# EAGLE design POE_plus_input (EAGLE 9.6.2)
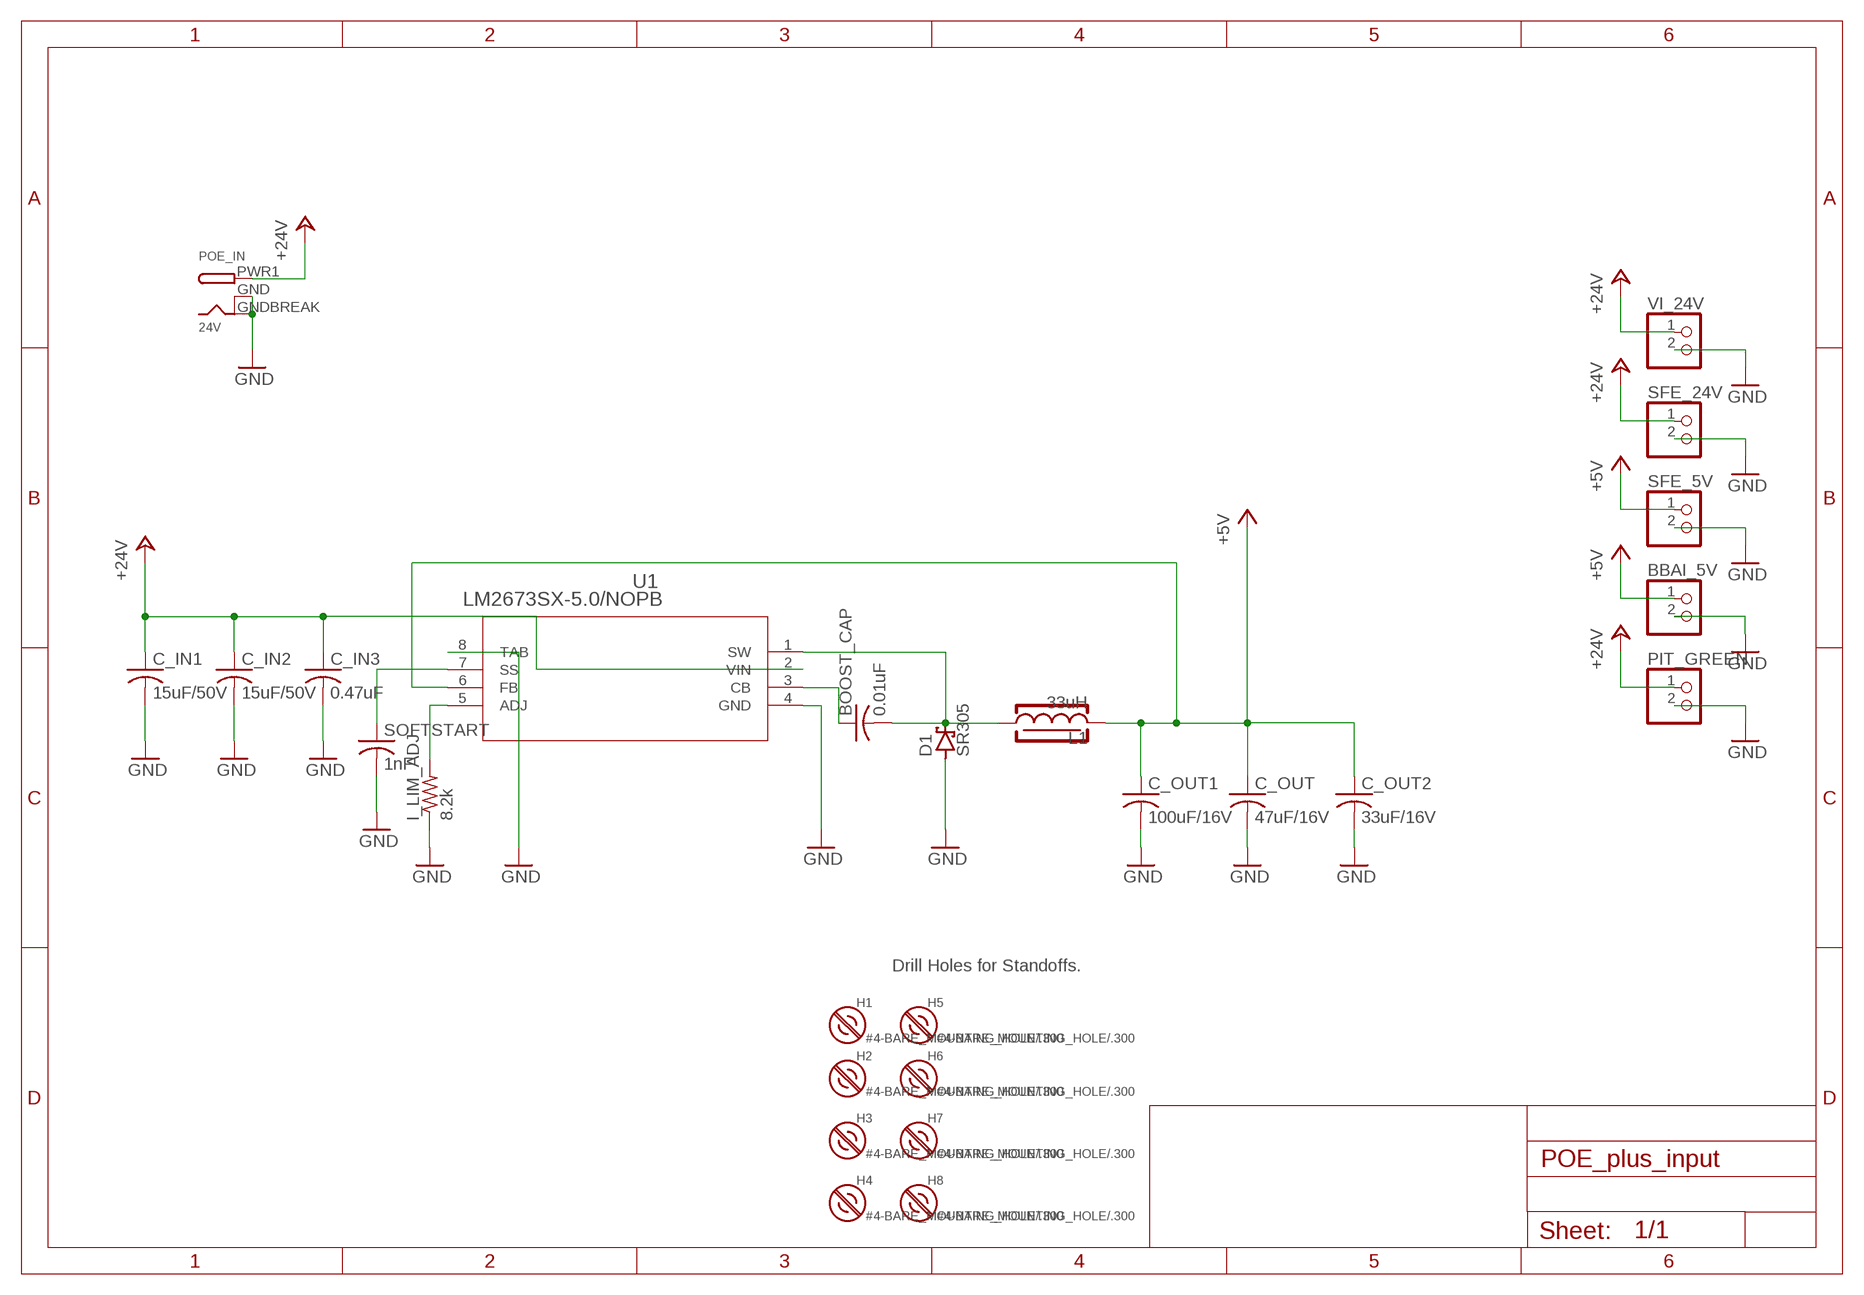
[diagram p0: schematic, sheet 1]

## Parts
BBAI_5V  PINHD-1X2  [1X02]
BOOST_CAP  0.01uF  C-USC0805K  [C0805K]
C_IN1  15uF/50V  C-USC2220K  [C2220K]
C_IN2  15uF/50V  C-USC2220K  [C2220K]
C_IN3  0.47uF  C-USC0805K  [C0805K]
C_OUT  47uF/16V  C-USC1210K  [C1210K]
C_OUT1  100uF/16V  C-USC1210K  [C1210K]
C_OUT2  33uF/16V  C-USC1206K  [C1206K]
D1  SR305  1N5908  [C4111-15]
H1  #4-BARE_MOUNTING_HOLE/.300  [#4/.300-BARE+STD_NUT_OR_STAR_WASHER]
H2  #4-BARE_MOUNTING_HOLE/.300  [#4/.300-BARE+STD_NUT_OR_STAR_WASHER]
H3  #4-BARE_MOUNTING_HOLE/.300  [#4/.300-BARE+STD_NUT_OR_STAR_WASHER]
H4  #4-BARE_MOUNTING_HOLE/.300  [#4/.300-BARE+STD_NUT_OR_STAR_WASHER]
H5  #4-BARE_MOUNTING_HOLE/.300  [#4/.300-BARE+STD_NUT_OR_STAR_WASHER]
H6  #4-BARE_MOUNTING_HOLE/.300  [#4/.300-BARE+STD_NUT_OR_STAR_WASHER]
H7  #4-BARE_MOUNTING_HOLE/.300  [#4/.300-BARE+STD_NUT_OR_STAR_WASHER]
H8  #4-BARE_MOUNTING_HOLE/.300  [#4/.300-BARE+STD_NUT_OR_STAR_WASHER]
I_LIM_ADJ  8.2k  R-US_1206-A  [1206-A]
L1  33uH  L_SHIELDED  [L_SHIELDED_13MMX13MMX6MM]
PIT_GREEN  PINHD-1X2  [1X02]
POE_IN  24V  DCBARRELSMT  [DCJACK_2MM_SMT]
SFE_5V  PINHD-1X2  [1X02]
SFE_24V  PINHD-1X2  [1X02]
SOFTSTART  1nF  C-USC0603K  [C0603K]
U1  LM2673SX-5.0/NOPB  [TS7B]
VI_24V  PINHD-1X2  [1X02]

## Nets
+5V: BBAI_5V.1 C_OUT1.1 C_OUT2.1 C_OUT.1 L1.2 SFE_5V.1 U1.6(FB)
+24V: C_IN1.1 C_IN2.1 C_IN3.1 PIT_GREEN.1 POE_IN.PWR1(PWR) SFE_24V.1 U1.2(VIN) VI_24V.1
GND: BBAI_5V.2 C_IN1.2 C_IN2.2 C_IN3.2 C_OUT1.2 C_OUT2.2 C_OUT.2 D1.A I_LIM_ADJ.1 PIT_GREEN.2 POE_IN.GND(GNDBREAK) POE_IN.GNDBREAK(GND) SFE_5V.2 SFE_24V.2 SOFTSTART.2 U1.4(GND) U1.8(TAB) VI_24V.2
N$1: SOFTSTART.1 U1.7(SS)
N$2: BOOST_CAP.2 D1.C L1.1 U1.1(SW)
N$6: I_LIM_ADJ.2 U1.5(ADJ)
N$7: BOOST_CAP.1 U1.3(CB)

## Notes on the sheet
- Drill Holes for Standoffs.

## Library data of the parts
BBAI_5V PIT_GREEN SFE_5V SFE_24V VI_24V = pinhead:PINHD-1X2: PIN HEADER; DIS: Digi-Key; DPN: WM10560CT-ND; MFR: Molex; MPN: 1718573002
BOOST_CAP = oresat-rcl:C-US: CAPACITOR, American symbol; DIS: Digi-Key; DPN: 478-5007-1-ND; MFR: AVX Corporation; MPN: 06035C103JAT2A
C_IN1 C_IN2 = oresat-rcl:C-US: CAPACITOR, American symbol; DIS: Digi-Key; DPN: 565-3335-1-ND; MFR: United Chemi-Con; MPN: KTS500B156M55N0T00
C_IN3 = oresat-rcl:C-US: CAPACITOR, American symbol; DIS: Digi-Key; DPN: 587-3171-1-ND; MFR: Taiyo Yuden; MPN: UMK107ABJ474KA-T
C_OUT = oresat-rcl:C-US: CAPACITOR, American symbol; DIS: Digi-Key; DPN: 490-16309-1-ND; MFR: Murata Electronics; MPN: GRM32EC81C476KE15K
C_OUT1 = oresat-rcl:C-US: CAPACITOR, American symbol; DIS: Digi-Key; DPN: 587-5426-1-ND; MFR: Taiyo Yuden; MPN: EMK325ABJ107MM-P
C_OUT2 = oresat-rcl:C-US: CAPACITOR, American symbol; DIS: Digi-Key; DPN: 445-6002-1-ND; MFR: TDK Corporation; MPN: C3216X5R1C336M160AB
D1 = diode:1N5908: DIODE schottky; DIS: Digi-Key; DPN: SR305-TPMSCT-ND; MFR: Micro Commercial Co; MPN: SR305-TP
H1-H8 = mount:#4-BARE_MOUNTING_HOLE: 1/8" drill hole for #4 screw mount
I_LIM_ADJ = oresat-rcl:R-US_: RESISTOR, American symbol; DIS: Digi-Key; DPN: 311-8.20KFRCT-ND; MFR: Yageo; MPN: RC1206FR-078K2L
L1 = oresat-rcl:L_SHIELDED: Wurth 6.0uH Shielded Inductor, 12A max Current, 14A Sat. Current, 8 mOhms, 13mm x 12.5mm x 6mm case, Wurth No. 7443551600, Digikey No. 732-1129-1-ND; DIS: Digi-Key; DPN: 553-1406-ND; MFR: Pulse Electronics Power; MPN: PE-53823SNL
POE_IN = adafruit:DCBARREL: 2.0mm DC Barrel Jack DCJACK_2MM_PTH - Through Hole Jack (4UConnector: 05537); DIS: Digi-Key; DPN: 2092-KLDX-SMT2-0202-ACT-ND; MFR: Kycon, Inc.; MPN: KLDX-SMT2-0202-ATR
SOFTSTART = oresat-rcl:C-US: CAPACITOR, American symbol; DIS: Digi-Key; DPN: 1276-1091-1-ND; MFR: Samsung Electro-Mechanics; MPN: CL10C102JB8NNNC
U1 = LM2673SX-5.0:NOPB:LM2673SX-5.0/NOPB; BASE_PN: LM2673; COMPTYPE: Switcher; DIS: Digi-Key; DPN: LM2673SX-5.0/NOPBCT-ND; MFR: Texas Instruments; MPN: LM2673SX-5.0/NOPB; PARTNUMBER: LM2673S-12; SYMBOL: NameLM2673S; TYPE: LM2673S-12; VENDOR: NationalSemiconductor; VERSION: 05/02/2007

## Board
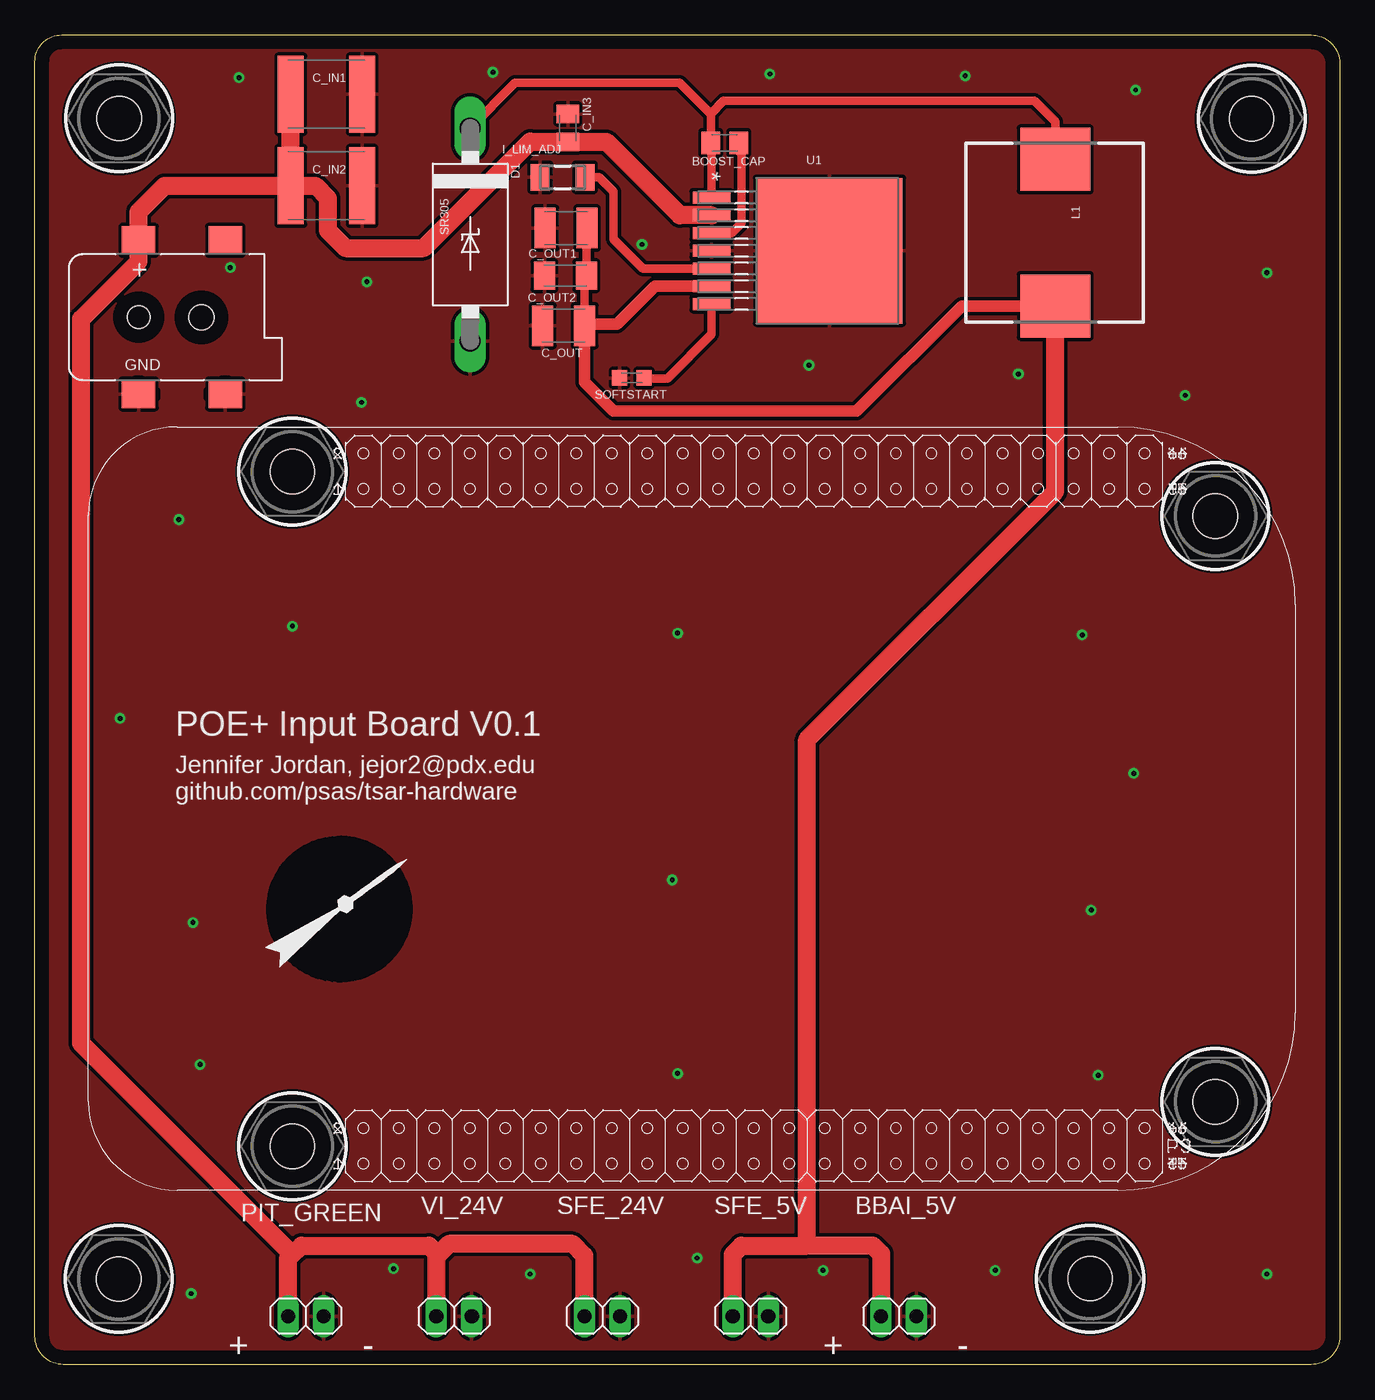
[diagram p1: board, top side]

Size 93.34 x 95.12 mm. Coordinates in mm from the lower left corner, seen from the top.
Outline: 1.91,95.12 91.31,95.12 arc-90 93.34,93.09 93.34,2.03 arc-90 91.31,0 2.03,0 arc-90 0,2.03 0,93.22 arc-90 1.91,95.12
Copper layers (1*16): Top 0.035mm / dielectric 1.5mm / Bottom 0.035mm
Design rules "default": minimum track width 6mil, minimum drill 0.35mm, track to track 6mil, track to pad 6mil, pad to pad 6mil, via to via 6mil, smd to smd 6mil, copper to edge 40mil, drill to drill 6mil, minimum pad ring 10mil, minimum via ring 8mil, stop-mask expansion 4mil, vias tented up to drill 0mil, thermal gap 10mil

### Footprints (pad centres in the part's own frame; a part is rotated, then mirrored left to right if it is on the bottom)
1X02 = drill 1.016 long: 1 -1.27,0; 2 1.27,0
C0805K = smd 1.3 x 1.6: 1 -1,0; 2 1,0
C2220K = smd 1.85 x 5.5: 1 -2.55,0; 2 2.55,0
C1210K = smd 1.5 x 2.9: 1 -1.5,0; 2 1.5,0
C1206K = smd 1.5 x 2: 1 -1.5,0; 2 1.5,0
C4111-15 = drill 1.499 long: A 7.62,0; C -7.62,0
#4/.300-BARE+STD_NUT_OR_STAR_WASHER = hole 3.175: 0,0
1206-A = smd 1.35 x 1.9: 1 -1.6,0; 2 1.6,0
L_SHIELDED_13MMX13MMX6MM = smd 4.5 x 5: 1 -5.25,0; 2 5.25,0
DCJACK_2MM_SMT = smd 2.4 x 2: GND 0,-5.5; GNDBREAK 6.2,-5.5; PWR1 0,5.5; PWR2 6.2,5.5 | hole 1.6: 0,0 | hole 1.8: 4.5,0
C0603K = smd 1.05 x 1.08: 1 -0.875,0; 2 0.875,0
TS7B = smd 0.864 x 2.692: 1 -3.81,-8.28; 2 -2.54,-8.28; 3 -1.27,-8.28; 4 0,-8.28; 5 1.27,-8.28; 6 2.54,-8.28; 7 3.81,-8.28 | smd 10.414 x 10.465: 8 0,0.152

### Placement (x,y rotation side)
BBAI_5V  61.8,3.45 0 top
BOOST_CAP  49.35,87.4 180 top
C_IN1  20.85,90.88 0 top
C_IN2  20.85,84.33 0 top
C_IN3  38.13,88.47 90 top
C_OUT  37.82,74.32 180 top
C_OUT1  38,81.31 180 top
C_OUT2  37.95,77.9 180 top
D1  31.14,80.85 270 top
H1  18.41,63.88 0 top
H2  18.41,15.62 0 top
H3  84.45,60.71 0 top
H4  84.45,18.8 0 top
H5  87.05,89.13 0 top
H6  6.02,89.15 0 top
H7  75.49,6.15 0 top
H8  5.99,6.12 0 top
I_LIM_ADJ  37.74,84.94 0 top
L1  73,80.98 270 top
PIT_GREEN  19.38,3.45 0 top
POE_IN  7.42,74.93 0 top
SFE_5V  51.19,3.45 0 top
SFE_24V  40.59,3.45 0 top
SOFTSTART  42.7,70.59 180 top
U1  56.69,79.68 270 top
U$5  [PSAS_LOGO_10X10]  21.84,32.64 0 top
VI_24V  29.98,3.45 0 top

### Tracks (layer width: path | path; a pad name or v marks a point on that pad's centre or on a via)
+5V
  Top 0.61: C_OUT.1 39.32,77.77 C_OUT2.1 39.45,81.25 C_OUT1.1
  Top 0.813: U1.6 44.35,77.14 41.66,74.45 39.45,74.45 C_OUT.1 39.32,70.28 41.4,68.2 58.78,68.2 66.31,75.72 L1.2
  Top 1.27: SFE_5V.1 49.92,7.89 50.55,8.51 55.24,8.51 | 55.24,8.51 59.94,8.51 60.53,7.92 BBAI_5V.1 | 55.24,8.51 55.24,44.7 73,62.46 L1.2
+24V
  Top 1.27: PIT_GREEN.1 18.11,7.57 18.24,7.7 | 18.24,7.7 19.05,8.51 28.19,8.51 28.71,7.99 | 28.71,7.99 VI_24V.1 | 28.71,7.99 28.84,7.86 29.62,8.64 38.48,8.64 39.32,7.8 SFE_24V.1 | 18.24,7.7 18.24,8.05 3.3,22.99 3.3,74.8 7.42,78.92 POE_IN.PWR1 7.42,82.47 9.27,84.33 C_IN2.1 | U1.2 46.14,82.22 40.89,87.47 C_IN3.1 38.09,87.5 35.43,87.5 27.81,79.88 22.23,79.88 20.95,81.15 20.95,83.44 20.07,84.33 C_IN2.1 | C_IN2.1 C_IN1.1
GND  (via drill 0.35)
  other vias: 45.97,52.32 45.59,34.67 18.41,52.83 74.93,52.2 75.56,32.51 11.3,31.62 10.29,60.45 13.97,78.49 23.75,77.47 43.43,80.14 70.36,70.87 88.14,78.1 82.3,69.34 55.37,71.5 23.37,68.83 14.61,92.07 32.77,92.46 52.58,92.33 66.55,92.2 78.74,91.19 76.07,20.7 45.97,20.83 11.81,21.46 11.18,5.08 25.65,6.86 35.43,6.48 47.37,7.62 56.39,6.73 68.71,6.73 88.14,6.48 6.1,46.23 78.61,42.29
  pour Top (isolate 0.254, rank 6): 0,-0.13 93.47,-0.13 93.47,95.12 0,95.12
N$1
  Top 0.61: SOFTSTART.1 43.62,70.54 45.24,70.54 48.41,73.71 U1.7
N$2
  Top 0.61: D1.C 34.37,91.69 46.1,91.69 48.35,89.44 BOOST_CAP.2 | BOOST_CAP.2 48.41,87.34 U1.1 | BOOST_CAP.2 48.35,89.5 49.28,90.42 71.5,90.42 73,88.92 L1.1
N$6
  Top 0.61: I_LIM_ADJ.2 40.36,84.94 41.4,83.9 41.4,80.52 43.51,78.41 U1.5
N$7
  Top 0.61: U1.3 49.84,80.95 50.55,81.66 50.55,86.57 50.35,86.77 BOOST_CAP.1

### Text on the board
tPlace: + - | + -
tNames: POE+ Input Board V0.1 | Jennifer Jordan, jejor2@pdx.edu / github.com/psas/tsar-hardware